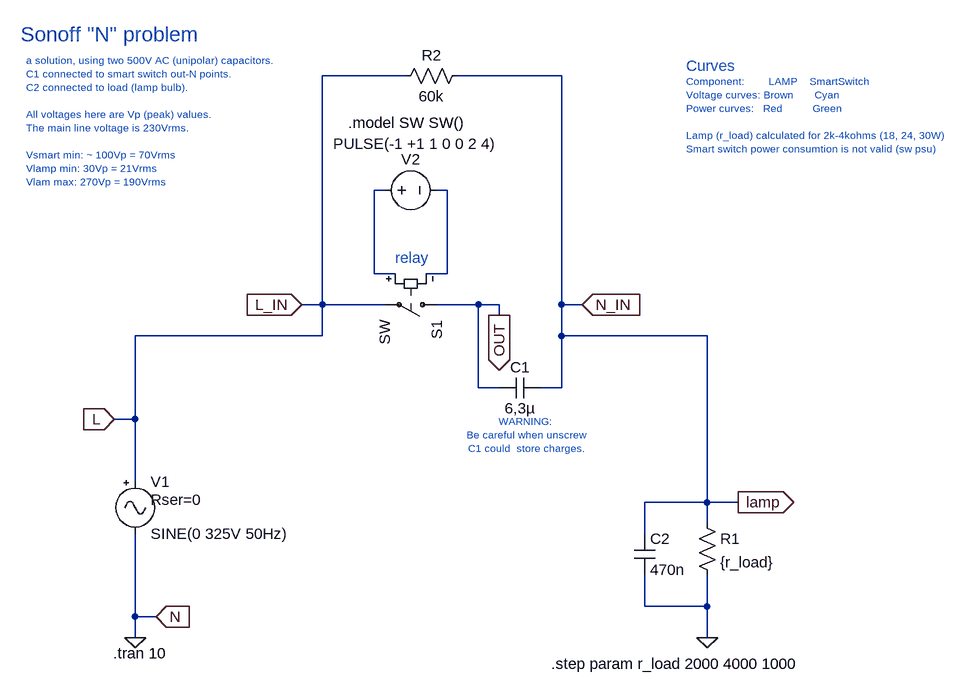
[diagram p0: schematic smartsw_N.asc]
smartsw_N.asc, the LTspice schematic file:
Version 4
SHEET 1 1236 680
WIRE -80 -1072 -208 -1072
WIRE 160 -1072 0 -1072
WIRE -112 -896 -128 -896
WIRE -16 -896 -32 -896
WIRE -128 -768 -128 -896
WIRE -96 -768 -128 -768
WIRE -16 -768 -16 -896
WIRE -16 -768 -48 -768
WIRE -208 -720 -208 -1072
WIRE -208 -720 -240 -720
WIRE -112 -720 -208 -720
WIRE 32 -720 -32 -720
WIRE 64 -720 32 -720
WIRE 160 -720 160 -1072
WIRE 192 -720 160 -720
WIRE 64 -704 64 -720
WIRE -208 -672 -208 -720
WIRE -208 -672 -496 -672
WIRE 160 -672 160 -720
WIRE 384 -672 160 -672
WIRE 32 -592 32 -720
WIRE 64 -592 32 -592
WIRE 160 -592 160 -672
WIRE 160 -592 128 -592
WIRE -496 -544 -496 -672
WIRE -496 -544 -528 -544
WIRE -496 -448 -496 -544
WIRE 384 -416 384 -672
WIRE 384 -416 288 -416
WIRE 432 -416 384 -416
WIRE 384 -384 384 -416
WIRE 288 -368 288 -416
WIRE 288 -256 288 -304
WIRE 384 -256 384 -304
WIRE 384 -256 288 -256
WIRE -496 -240 -496 -368
WIRE -464 -240 -496 -240
WIRE -496 -208 -496 -240
WIRE 384 -208 384 -256
FLAG -496 -208 0
FLAG 384 -208 0
FLAG 432 -416 lamp
IOPIN 432 -416 Out
FLAG 64 -704 OUT
IOPIN 64 -704 Out
FLAG -528 -544 L
IOPIN -528 -544 In
FLAG -464 -240 N
IOPIN -464 -240 In
FLAG 192 -720 N_IN
IOPIN 192 -720 In
FLAG -240 -720 L_IN
IOPIN -240 -720 In
SYMBOL res 368 -400 R0
SYMATTR InstName R1
SYMATTR Value {r_load}
SYMBOL Misc\\signal -496 -464 R0
WINDOW 123 0 0 Left 0
WINDOW 39 24 44 Left 2
SYMATTR InstName V1
SYMATTR Value SINE(0 325V 50Hz)
SYMATTR SpiceLine Rser=0
SYMBOL sw -16 -720 R90
SYMATTR InstName S1
SYMBOL cap 128 -608 R90
WINDOW 0 0 32 VBottom 2
WINDOW 3 32 32 VTop 2
SYMATTR InstName C1
SYMATTR Value 6,3µ
SYMATTR SpiceLine V=400
SYMBOL voltage -128 -896 M90
WINDOW 0 -32 56 VBottom 2
WINDOW 3 -87 63 VTop 2
WINDOW 123 0 0 Left 0
WINDOW 39 0 0 Left 0
SYMATTR InstName V2
SYMATTR Value PULSE(-1 +1 1 0 0 2 4)
SYMBOL res 16 -1088 R90
WINDOW 0 0 56 VBottom 2
WINDOW 3 32 56 VTop 2
SYMATTR InstName R2
SYMATTR Value 60k
SYMATTR SpiceLine pwr=1
SYMBOL cap 272 -368 R0
SYMATTR InstName C2
SYMATTR Value 470n
TEXT -530 -184 Left 2 !.tran 10
TEXT -168 -1000 Left 2 !.model SW SW()
TEXT -672 -1136 Left 3 ;Sonoff "N" problem
TEXT -664 -1096 Left 1 ;a solution, using two 500V AC (unipolar) capacitors.\nC1 connected to smart switch out-N points.\nC2 connected to load (lamp bulb).\n \nAll voltages here are Vp (peak) values.\nThe main line voltage is 230Vrms.\n \nVsmart min: ~ 100Vp = 70Vrms\nVlamp min: 30Vp = 21Vrms\nVlam max: 270Vp = 190Vrms
TEXT 144 -168 Left 2 !.step param r_load 2000 4000 1000
TEXT 352 -1064 Left 1 ;Component:        LAMP    SmartSwitch\nVoltage curves: Brown       Cyan\nPower curves:   Red          Green\n \nLamp (r_load) calculated for 2k-4kohms (18, 24, 30W)\nSmart switch power consumtion is not valid (sw psu)
TEXT -96 -792 Left 2 ;relay
TEXT 104 -520 Center 1 ;WARNING:\nBe careful when unscrew\nC1 could  store charges.
TEXT 352 -1088 Left 2 ;Curves

The netlist it stands for:
* smartsw_N.asc
R1 N_IN 0 {r_load}
V1 L_IN 0 SINE(0 325V 50Hz) Rser=0
S1 OUT L_IN N001 N002 SW
C1 N_IN OUT 6,3µ V=400
V2 N001 N002 PULSE(-1 +1 1 0 0 2 4)
R2 N_IN L_IN 60k pwr=1
C2 N_IN 0 470n
.tran 10
.model SW SW()
* Sonoff "N" problem
* a solution, using two 500V AC (unipolar) capacitors.
* C1 connected to smart switch out-N points.
* C2 connected to load (lamp bulb).
* All voltages here are Vp (peak) values.
* The main line voltage is 230Vrms.
* Vsmart min: ~ 100Vp = 70Vrms
* Vlamp min: 30Vp = 21Vrms
* Vlam max: 270Vp = 190Vrms
.step param r_load 2000 4000 1000
* Component:        LAMP    SmartSwitch
* Voltage curves: Brown       Cyan
* Power curves:   Red          Green
* Lamp (r_load) calculated for 2k-4kohms (18, 24, 30W)
* Smart switch power consumtion is not valid (sw psu)
* relay
* WARNING:
* Be careful when unscrew
* C1 could  store charges.
* Curves
.backanno
.end